# Altium schematic sheet Updiy.SchDoc
size A3; SheetNumber: 1; SheetTotal: 1
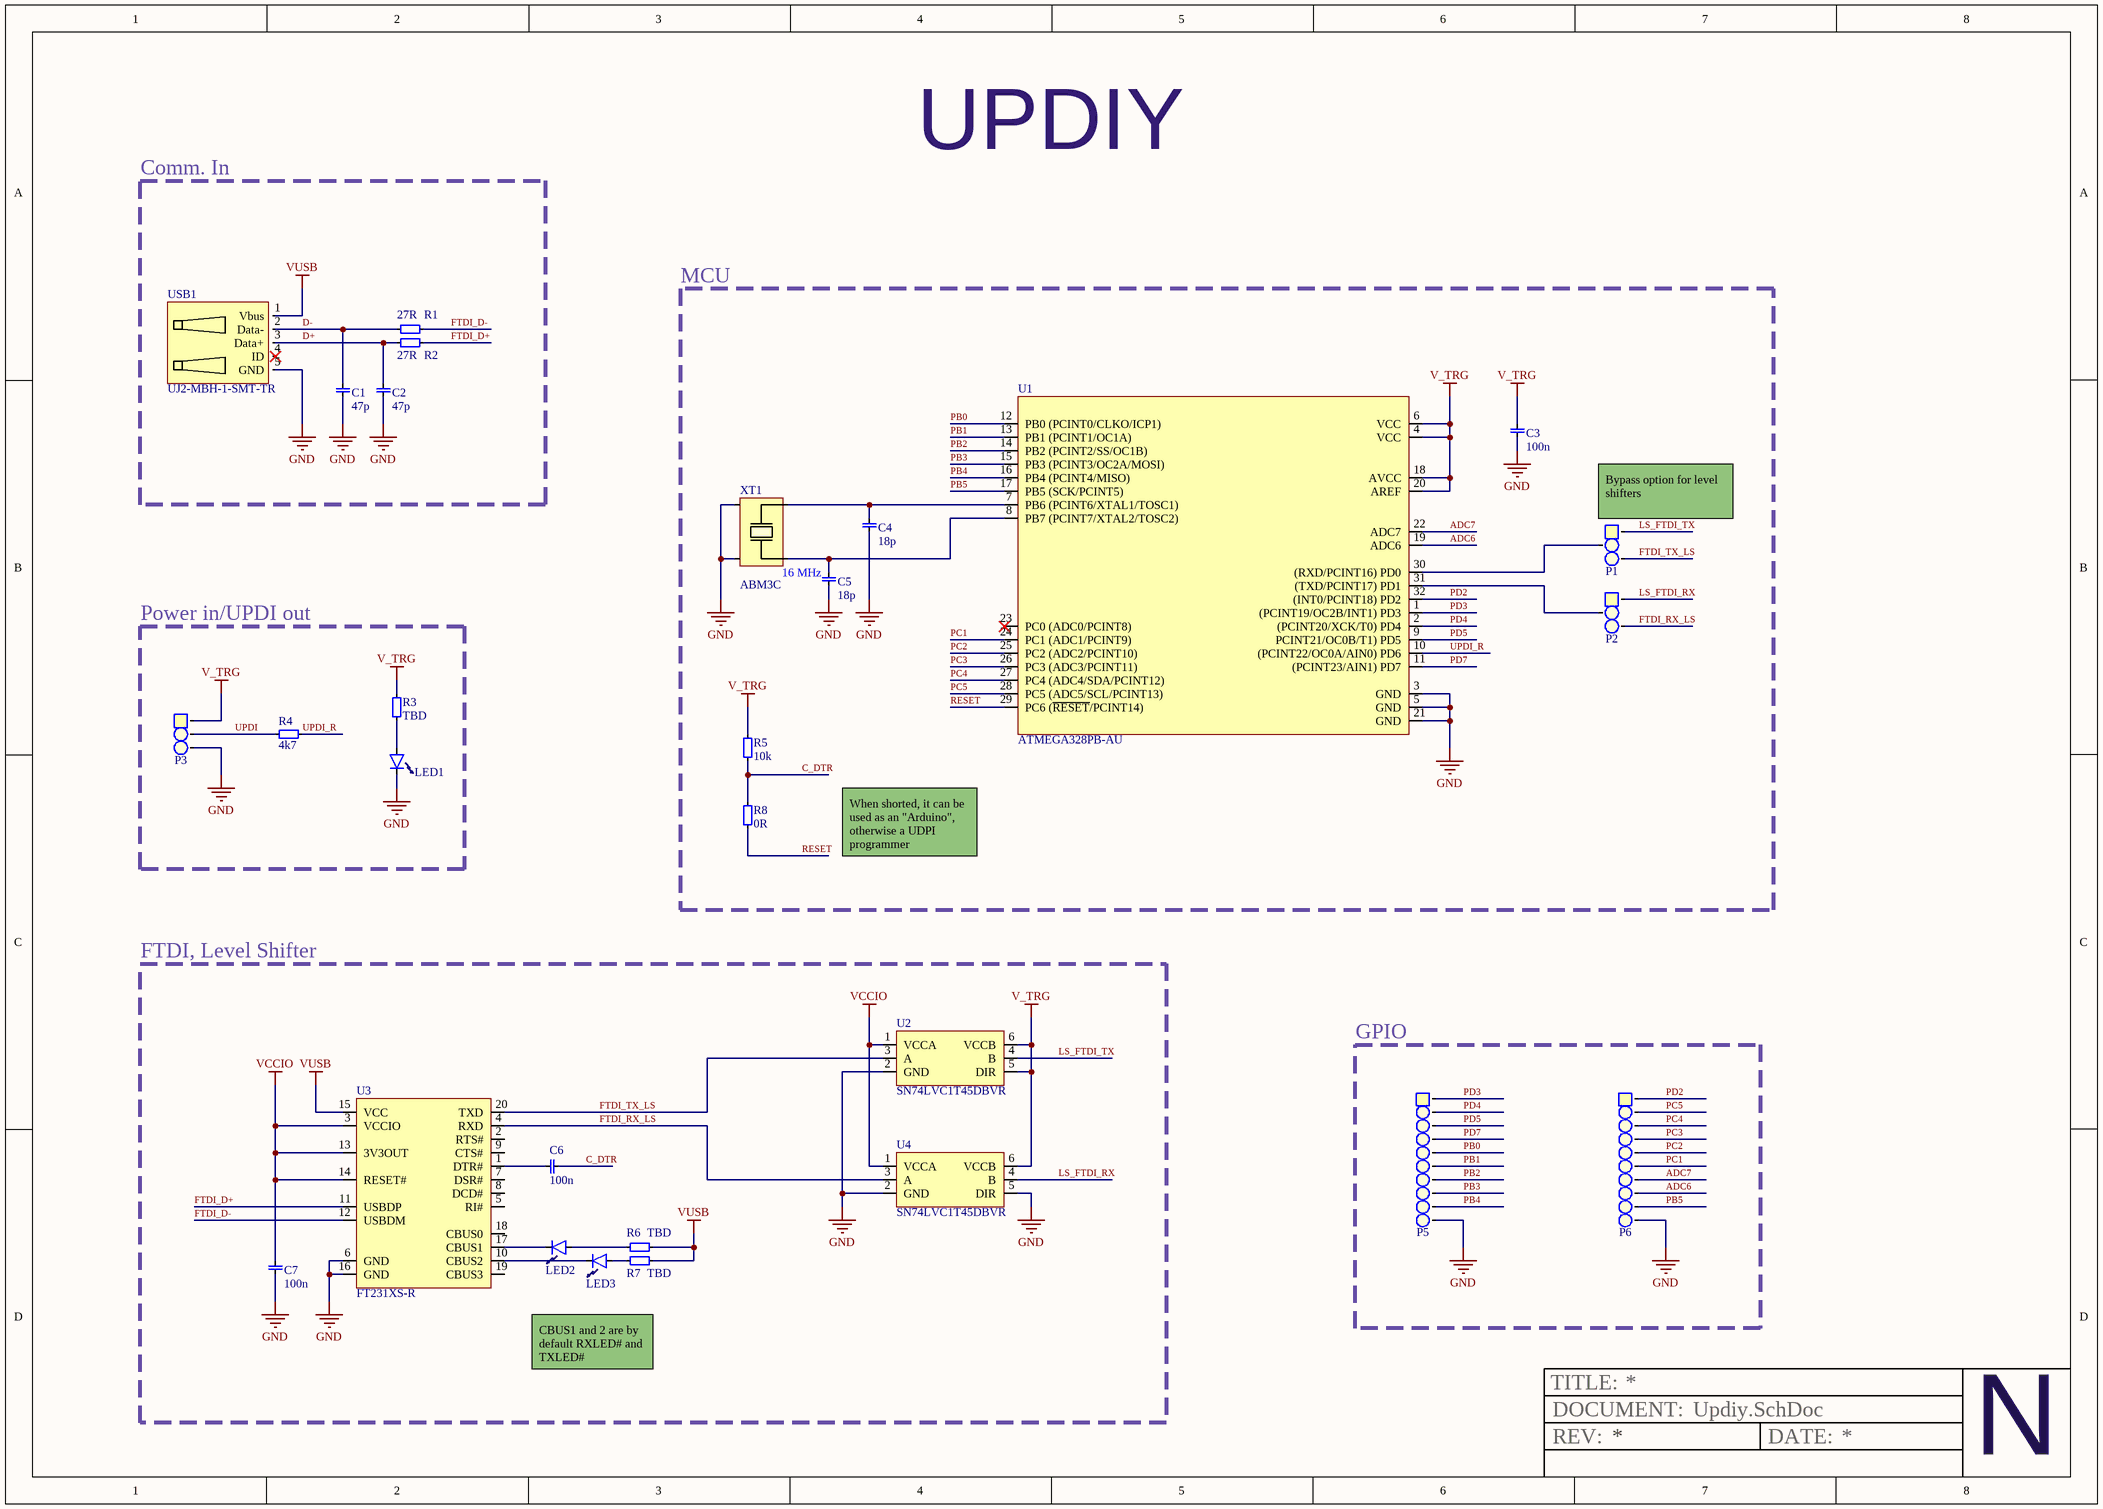
[diagram p0: Updiy.SchDoc]

## Parts
C1  value 47p  [0805, cap]  (hidden comment: 0805, capacitor)
C2  value 47p  [0805, cap]  (hidden comment: 0805, capacitor)
C3  value 100n  [0805, cap]  (hidden comment: 0805, capacitor)
C4  value 18p  [0805, cap]  (hidden comment: 0805, capacitor)
C5  value 18p  [0805, cap]  (hidden comment: 0805, capacitor)
C6  value 100n  [0805, cap]  (hidden comment: 0805, capacitor)
C7  value 100n  [0805, cap]  (hidden comment: 0805, capacitor)
LED1  0805, LED  [0805_led]  (value not drawn)
LED2  0805, LED  [0805_led]  (value not drawn)
LED3  0805, LED  [0805_led]  (value not drawn)
P1  1x3 Pin Header Mux  [padThree_L]  (value not drawn)
P2  1x3 Pin Header Mux  [padThree_L]  (value not drawn)
P3  1x3 Pin Header  [padThree_L]  (value not drawn)
P5  1x10 Pin Header  [1x10 PIN HEADER]  (value not drawn)
P6  1x10 Pin Header  [1x10 PIN HEADER]  (value not drawn)
R1  value 27R  [0805]  (hidden comment: General resistor)
R2  value 27R  [0805]  (hidden comment: General resistor)
R3  value TBD  [0805]  (hidden comment: General resistor)
R4  value 4k7  [0805]  (hidden comment: General resistor)
R5  value 10k  [0805]  (hidden comment: General resistor)
R6  value TBD  [0805]  (hidden comment: General resistor)
R7  value TBD  [0805]  (hidden comment: General resistor)
R8  value 0R  [0805]  (hidden comment: General resistor)
U1  ATMEGA328PB-AU  [TQFP32_P08MM]
U2  SN74LVC1T45DBVR  [SOT23-6]
U3  FT231XS-R  [SSOP-20_P0.635]
U4  SN74LVC1T45DBVR  [SOT23-6]
USB1  UJ2-MBH-1-SMT-TR  [USB-MINI_UJ2-MBH-SMT]
XT1  ABM3C  [ABM3B]

## Blocks framed on the sheet
Comm. In: C1 C2 R1 R2 USB1
MCU: C3-C5 P1 P2 R5 R8 U1 XT1
Power in/UPDI out: LED1 P3 R3 R4
FTDI, Level Shifter: C6 C7 LED2 LED3 R6 R7 U2-U4
GPIO: P5 P6

## Nets
GND: C1.0 C2.0 C3.1 C4.0 C5.0 C7.0 LED1.0(Cathode) P3.3 P5.10 P6.10 U1.3(GND) U1.5(GND) U1.21(GND) U2.2(GND) U3.6(GND) U3.16(GND) U4.2(GND) U4.5(DIR) USB1.5(GND) XT1.2 XT1.4
V_TRG: C3.0 P3.1 R3.1 R5.1 U1.4(VCC) U1.6(VCC) U1.18(AVCC) U1.20(AREF) U2.5(DIR) U2.6(VCCB) U4.6(VCCB)
VCCIO: C7.1 U2.1(VCCA) U3.3(VCCIO) U3.13(3V3OUT) U3.14(RESET#) U4.1(VCCA)
VUSB: R6.1 R7.0 U3.15(VCC) USB1.1(Vbus)
ADC6: P6.8 U1.19(ADC6)
ADC7: P6.7 U1.22(ADC7)
C_DTR: C6.0 R5.0 R8.1
D+: C2.1 R2.1 USB1.3(Data+)
D-: C1.1 R1.1 USB1.2(Data-)
FTDI_D+: R2.0 U3.11(USBDP)
FTDI_D-: R1.0 U3.12(USBDM)
FTDI_RX_LS: P2.3 U3.4(RXD) U4.3(A)
FTDI_TX_LS: P1.3 U2.3(A) U3.20(TXD)
LS_FTDI_RX: P2.1 U4.4(B)
LS_FTDI_TX: P1.1 U2.4(B)
PB0: P5.5 U1.12(PB0_(PCINT0/CLKO/ICP1))
PB1: P5.6 U1.13(PB1_(PCINT1/OC1A))
PB2: P5.7 U1.14(PB2_(PCINT2/SS/OC1B))
PB3: P5.8 U1.15(PB3_(PCINT3/OC2A/MOSI))
PB4: P5.9 U1.16(PB4_(PCINT4/MISO))
PB5: P6.9 U1.17(PB5_(SCK/PCINT5))
PC1: P6.6 U1.24(PC1_(ADC1/PCINT9))
PC2: P6.5 U1.25(PC2_(ADC2/PCINT10))
PC3: P6.4 U1.26(PC3_(ADC3/PCINT11))
PC4: P6.3 U1.27(PC4_(ADC4/SDA/PCINT12))
PC5: P6.2 U1.28(PC5_(ADC5/SCL/PCINT13))
PD2: P6.1 U1.32((INT0/PCINT18)_PD2)
PD3: P5.1 U1.1((PCINT19/OC2B/INT1)_PD3)
PD4: P5.2 U1.2((PCINT20/XCK/T0)_PD4)
PD5: P5.3 U1.9(PCINT21/OC0B/T1)_PD5)
PD7: P5.4 U1.11((PCINT23/AIN1)_PD7)
RESET: R8.0 U1.29(PC6_(~{RESET}/PCINT14))
UPDI: P3.2 R4.1
UPDI_R: R4.0 U1.10((PCINT22/OC0A/AIN0)_PD6)
NetC4_1: C4.1 U1.7(PB6_(PCINT6/XTAL1/TOSC1)) XT1.1
NetC5_1: C5.1 U1.8(PB7_(PCINT7/XTAL2/TOSC2)) XT1.3
NetC6_1: C6.1 U3.1(DTR#)
NetLED1_1: LED1.1 R3.0
NetLED2_0: LED2.0(Cathode) U3.17(CBUS1)
NetLED2_1: LED2.1 R6.0
NetLED3_0: LED3.0(Cathode) U3.10(CBUS2)
NetLED3_1: LED3.1 R7.1
NetP1_2: P1.2 U1.30((RXD/PCINT16)_PD0)
NetP2_2: P2.2 U1.31((TXD/PCINT17)_PD1)

Not connected (* = marked no-connect by the designer): U1 23(PC0_(ADC0/PCINT8))*; U3 2(RTS#) 5(RI#) 7(DSR#) 8(DCD#) 9(CTS#) 18(CBUS0) 19(CBUS3); USB1 4(ID)*

## Notes on the sheet
- UPDIY
- (near P1) Bypass option for level shifters
- When shorted, it can be used as an "Arduino", otherwise a UDPI programmer
- CBUS1 and 2 are by default RXLED# and TXLED#
- TITLE:
- REV:
- DOCUMENT:
- DATE:
- N

## Library data of the parts
LED1-LED3 = 0805, LED: Value: 0805 LED
P1 P2 = 1x3 Pin Header Mux: 2.54 mm; Value: 1x3 Pin Header
P3 = 1x3 Pin Header: 2.54 mm; Value: 1x3 Pin Header
P5 P6 = 1x10 Pin Header: 2.54 mm; Value: 1x8 Pin Header
R1-R8 = resistor
U1 = ATMEGA328PB-AU: RISC Microcontroller, CMOS; Manufacturer: Microchip; Supplier 1: Mouser; Manufacturer Part Number: ATMEGA328PB-AU; RoHS: No; Stock 1: 44838; Pricing 1: 1=1,7, 10=1,7, 50=1,56, 100=1,42, 1000=1,42, 10000=1,42 (USD); Technology: CMOS; ComponentLink1URL: https://datasheet.ciiva.com:443/pdfs/VipMasterIC/IC/ATML/ATML-S-A0001248617/ATML-S-A0001248617-1.pdf?src-supplier=IHS+Markit; ComponentLink1Description: https://datasheet.ciiva.com:443/pdfs/VipMasterIC/IC/ATML/ATML-S-A0001248617/ATML-S-A0001248617-1.pdf?src-supplier=IHS+Markit; ComponentLink2URL: http://www.farnell.com/datasheets/2014286.pdf?src-supplier=Farnell; ComponentLink2Description: http://www.farnell.com/datasheets/2014286.pdf?src-supplier=Farnell; ComponentLink3URL: http://www.atmel.com/images/atmel-42397-8-bit-avr-microcontroller-atmega328pb_summary.pdf?src-supplier=Avnet; ComponentLink3Description: http://www.atmel.com/images/atmel-42397-8-bit-avr-microcontroller-atmega328pb_summary.pdf?src-supplier=Avnet; ComponentLink4URL: http://www.microchip.com/mymicrochip/filehandler.aspx?ddocname=en589666&src-supplier=Digi-Key; ComponentLink4Description: http://www.microchip.com/mymicrochip/filehandler.aspx?ddocname=en589666&src-supplier=Digi-Key; ComponentLink5URL: https://datasheet.octopart.com/ATMEGA328PB-AU-Microchip-datasheet-62062422.pdf?src-supplier=Farnell; ComponentLink5Description: https://datasheet.octopart.com/ATMEGA328PB-AU-Microchip-datasheet-62062422.pdf?src-supplier=Farnell; ComponentLink6URL: http://www.farnell.com/datasheets/2014286.pdf?src-supplier=Element14; ComponentLink6Description: http://www.farnell.com/datasheets/2014286.pdf?src-supplier=Element14; ComponentLink7URL: http://www.farnell.com/datasheets/2014286.pdf?src-supplier=Newark; ComponentLink7Description: http://www.farnell.com/datasheets/2014286.pdf?src-supplier=Newark; ComponentLink8URL: https://datasheet.octopart.com/ATMEGA328PB-AU-Microchip-datasheet-81466992.pdf?src-supplier=TME; ComponentLink8Description: https://datasheet.octopart.com/ATMEGA328PB-AU-Microchip-datasheet-81466992.pdf?src-supplier=TME; ComponentLink9URL: https://datasheet.octopart.com/ATMEGA328PB-AU-Microchip-datasheet-154741725.pdf?src-supplier=Electro+Sonic; ComponentLink9Description: https://datasheet.octopart.com/ATMEGA328PB-AU-Microchip-datasheet-154741725.pdf?src-supplier=Electro+Sonic; Supplier Part Number 1: 556-ATMEGA328PB-AU
U2 U4 = SN74LVC1T45DBVR: Bus Transceiver, LVC/LCX/Z Series, 1-Func, 1-Bit, True Output, CMOS, PDSO6, Level shift; Manufacturer: Texas Instruments; Package Body Material: Plastic; Control Type: COMMON CONTROL; Count Direction: Bidirectional; Max I(ol): 24mA; Number of Bits: 1; Number of Ports: 2; Output Characteristics: 3-STATE; Package Equivalence Code: TSOP6,.11,37; Power Supplies: 3.3V; Propagation Delay (tpd): 17.7ns; Max Supply Voltage: 5.5V; Min Supply Voltage: 1.65V; Nominal Supply Voltage: 1.8V; Load/Preset Input: Yes; Qualification Status: Not Qualified; Supplier 1: Mouser; Manufacturer Part Number: SN74LVC1T45DBVR; RoHS: Yes; Category: Logic Gates; Stock 1: 187756; Pricing 1: 1=0,61, 10=0,494, 50=0,494, 100=0,367, 1000=0,24, 10000=0,19 (USD); Case/Package: LSSOP; Pins: 6; Package Shape: Rectangular; Terminal Finish: Nickel; Min Operating Temperature: -40°C; Max Operating Temperature: 85°C; JESD-609 Code: e4; Output Polarity: True; JESD-30 Code: R-PDSO-G6; Logic Type: BUS TRANSCEIVER; Moisture Sensitivity Level: 1; Channels: 1; Package Style: SMALL OUTLINE, LOW PROFILE, SHRINK PITCHMeter; Packaging: Tape and Reel; Peak Reflow Temperature (Cel): 260°C; Surface Mount: Yes; Technology: CMOS; Terminal Form: Gull Wing; Terminal Position: DUAL; Length: 2.9mm; Width: 1.6mm; Height - Seated (Max): 1.45mm; Terminal Pitch: 0.95mm; Temperature Grade: INDUSTRIAL; Reach SVHC Compliant: Yes; RoHS Compliant: Yes; ComponentLink1URL: https://www.ti.com:443/lit/ds/symlink/sn74lvc1t45.pdf?src-supplier=IHS+Markit; ComponentLink1Description: https://www.ti.com:443/lit/ds/symlink/sn74lvc1t45.pdf?src-supplier=IHS+Markit; ComponentLink2URL: https://datasheet.ciiva.com/27055/2000549-27055985.pdf?src-supplier=Jameco; ComponentLink2Description: https://datasheet.ciiva.com/27055/2000549-27055985.pdf?src-supplier=Jameco; ComponentLink3URL: https://datasheet.ciiva.com/23943/1772421-23943378.pdf?src-supplier=Newark; ComponentLink3Description: https://datasheet.ciiva.com/23943/1772421-23943378.pdf?src-supplier=Newark; ComponentLink4URL: https://datasheet.ciiva.com/15086/getdatasheetpartid-309359-15086627.pdf?src-supplier=Verical; ComponentLink4Description: https://datasheet.ciiva.com/15086/getdatasheetpartid-309359-15086627.pdf?src-supplier=Verical; ComponentLink5URL: https://datasheet.ciiva.com/1899/sn74lvc1t45-1899260.pdf?src-supplier=Digi-Key; ComponentLink5Description: https://datasheet.ciiva.com/1899/sn74lvc1t45-1899260.pdf?src-supplier=Digi-Key; ComponentLink6URL: https://datasheet.ciiva.com/1899/sn74lvc1t45-1899261.pdf?src-supplier=Digi-Key; ComponentLink6Description: https://datasheet.ciiva.com/1899/sn74lvc1t45-1899261.pdf?src-supplier=Digi-Key; ComponentLink7URL: https://datasheet.ciiva.com/1899/sn74lvc1t45-1899262.pdf?src-supplier=Digi-Key; ComponentLink7Description: https://datasheet.ciiva.com/1899/sn74lvc1t45-1899262.pdf?src-supplier=Digi-Key; ComponentLink8URL: https://datasheet.ciiva.com/7293/1862463-7293669.pdf?src-supplier=Newark; ComponentLink8Description: https://datasheet.ciiva.com/7293/1862463-7293669.pdf?src-supplier=Newark; Supplier Part Number 1: 595-SN74LVC1T45DBVR
U3 = FT231XS-R: Microprocessor Circuit, CMOS, PDSO20; Manufacturer: FTDI; Package Body Material: Plastic; Package Equivalence Code: SSOP20,.25; Power Supplies: 3.3/5V; Max Supply Current: 8.4mA; Max Supply Voltage: 5.5V; Min Supply Voltage: 2.97V; Nominal Supply Voltage: 5V; Qualification Status: Not Qualified; Supplier 1: Arrow Electronics; Manufacturer Part Number: FT231XS-R; RoHS: Yes; Category: Interface ICs; Stock 1: 6000; Pricing 1: 2000=2,15 (USD); Case/Package: SSOP; Pins: 20; Package Shape: Rectangular; Terminal Finish: Tin; Min Operating Temperature: -40°C; Max Operating Temperature: 85°C; JESD-609 Code: e3; JESD-30 Code: R-PDSO-G20; Moisture Sensitivity Level: 3; Package Style: SMALL OUTLINE, SHRINK PITCHMeter; Surface Mount: Yes; Technology: CMOS; Terminal Form: Gull Wing; Terminal Position: DUAL; Length: 8.6614mm; Width: 3.9116mm; Height - Seated (Max): 1.7526mm; Terminal Pitch: 0.635mm; Temperature Grade: INDUSTRIAL; Reach SVHC Compliant: Yes; RoHS Compliant: Yes; ComponentLink1URL: https://datasheet.ciiva.com:443/pdfs/VipMasterIC/IC/FTDI/FTDIS00099/FTDIS00099-1.pdf?src-supplier=IHS+Markit; ComponentLink1Description: https://datasheet.ciiva.com:443/pdfs/VipMasterIC/IC/FTDI/FTDIS00099/FTDIS00099-1.pdf?src-supplier=IHS+Markit; ComponentLink2URL: https://datasheet.ciiva.com/30478/0900766b811020d3-30478147.pdf?src-supplier=Rs; ComponentLink2Description: https://datasheet.ciiva.com/30478/0900766b811020d3-30478147.pdf?src-supplier=Rs; ComponentLink3URL: https://datasheet.ciiva.com/1787/ft-x-series-1787028.pdf?src-supplier=Digi-Key; ComponentLink3Description: https://datasheet.ciiva.com/1787/ft-x-series-1787028.pdf?src-supplier=Digi-Key; ComponentLink4URL: https://datasheet.ciiva.com/1787/ft-x-series-1787029.pdf?src-supplier=Digi-Key; ComponentLink4Description: https://datasheet.ciiva.com/1787/ft-x-series-1787029.pdf?src-supplier=Digi-Key; ComponentLink5URL: https://datasheet.ciiva.com/1787/ft-x-series-1787030.pdf?src-supplier=Digi-Key; ComponentLink5Description: https://datasheet.ciiva.com/1787/ft-x-series-1787030.pdf?src-supplier=Digi-Key; ComponentLink6URL: https://datasheet.ciiva.com/48909/70403932-48909078.pdf?src-supplier=Allied+Electronics; ComponentLink6Description: https://datasheet.ciiva.com/48909/70403932-48909078.pdf?src-supplier=Allied+Electronics; Supplier Part Number 1: FT231XS-R
USB1 = USB Mini SMD: USB Connector, 5 Contact(s), Female, Right Angle, Surface Mount Terminal, Receptacle; Manufacturer: CUI Devices; Supplier 1: Arrow Electronics; Manufacturer Part Number: UJ2-MBH-1-SMT-TR; RoHS: Yes; Category: Connectors; Stock 1: 12000; Pricing 1: 750=0,246, 2250=0,2349, 4500=0,2286, 9750=0,2158, 24750=0,2148 (USD); ComponentLink1URL: https://www.cuidevices.com/product/resource/digikeypdf/uj2-mbh-smt.pdf?src-supplier=Digi-Key; ComponentLink1Description: https://www.cuidevices.com/product/resource/digikeypdf/uj2-mbh-smt.pdf?src-supplier=Digi-Key; Supplier Part Number 1: UJ2-MBH-1-SMT-TR
XT1 = XTAL ABM3C: 16 MHz